# Altium schematic sheet STALO_1.SchDoc: STALO_1 (part 2 of 2)
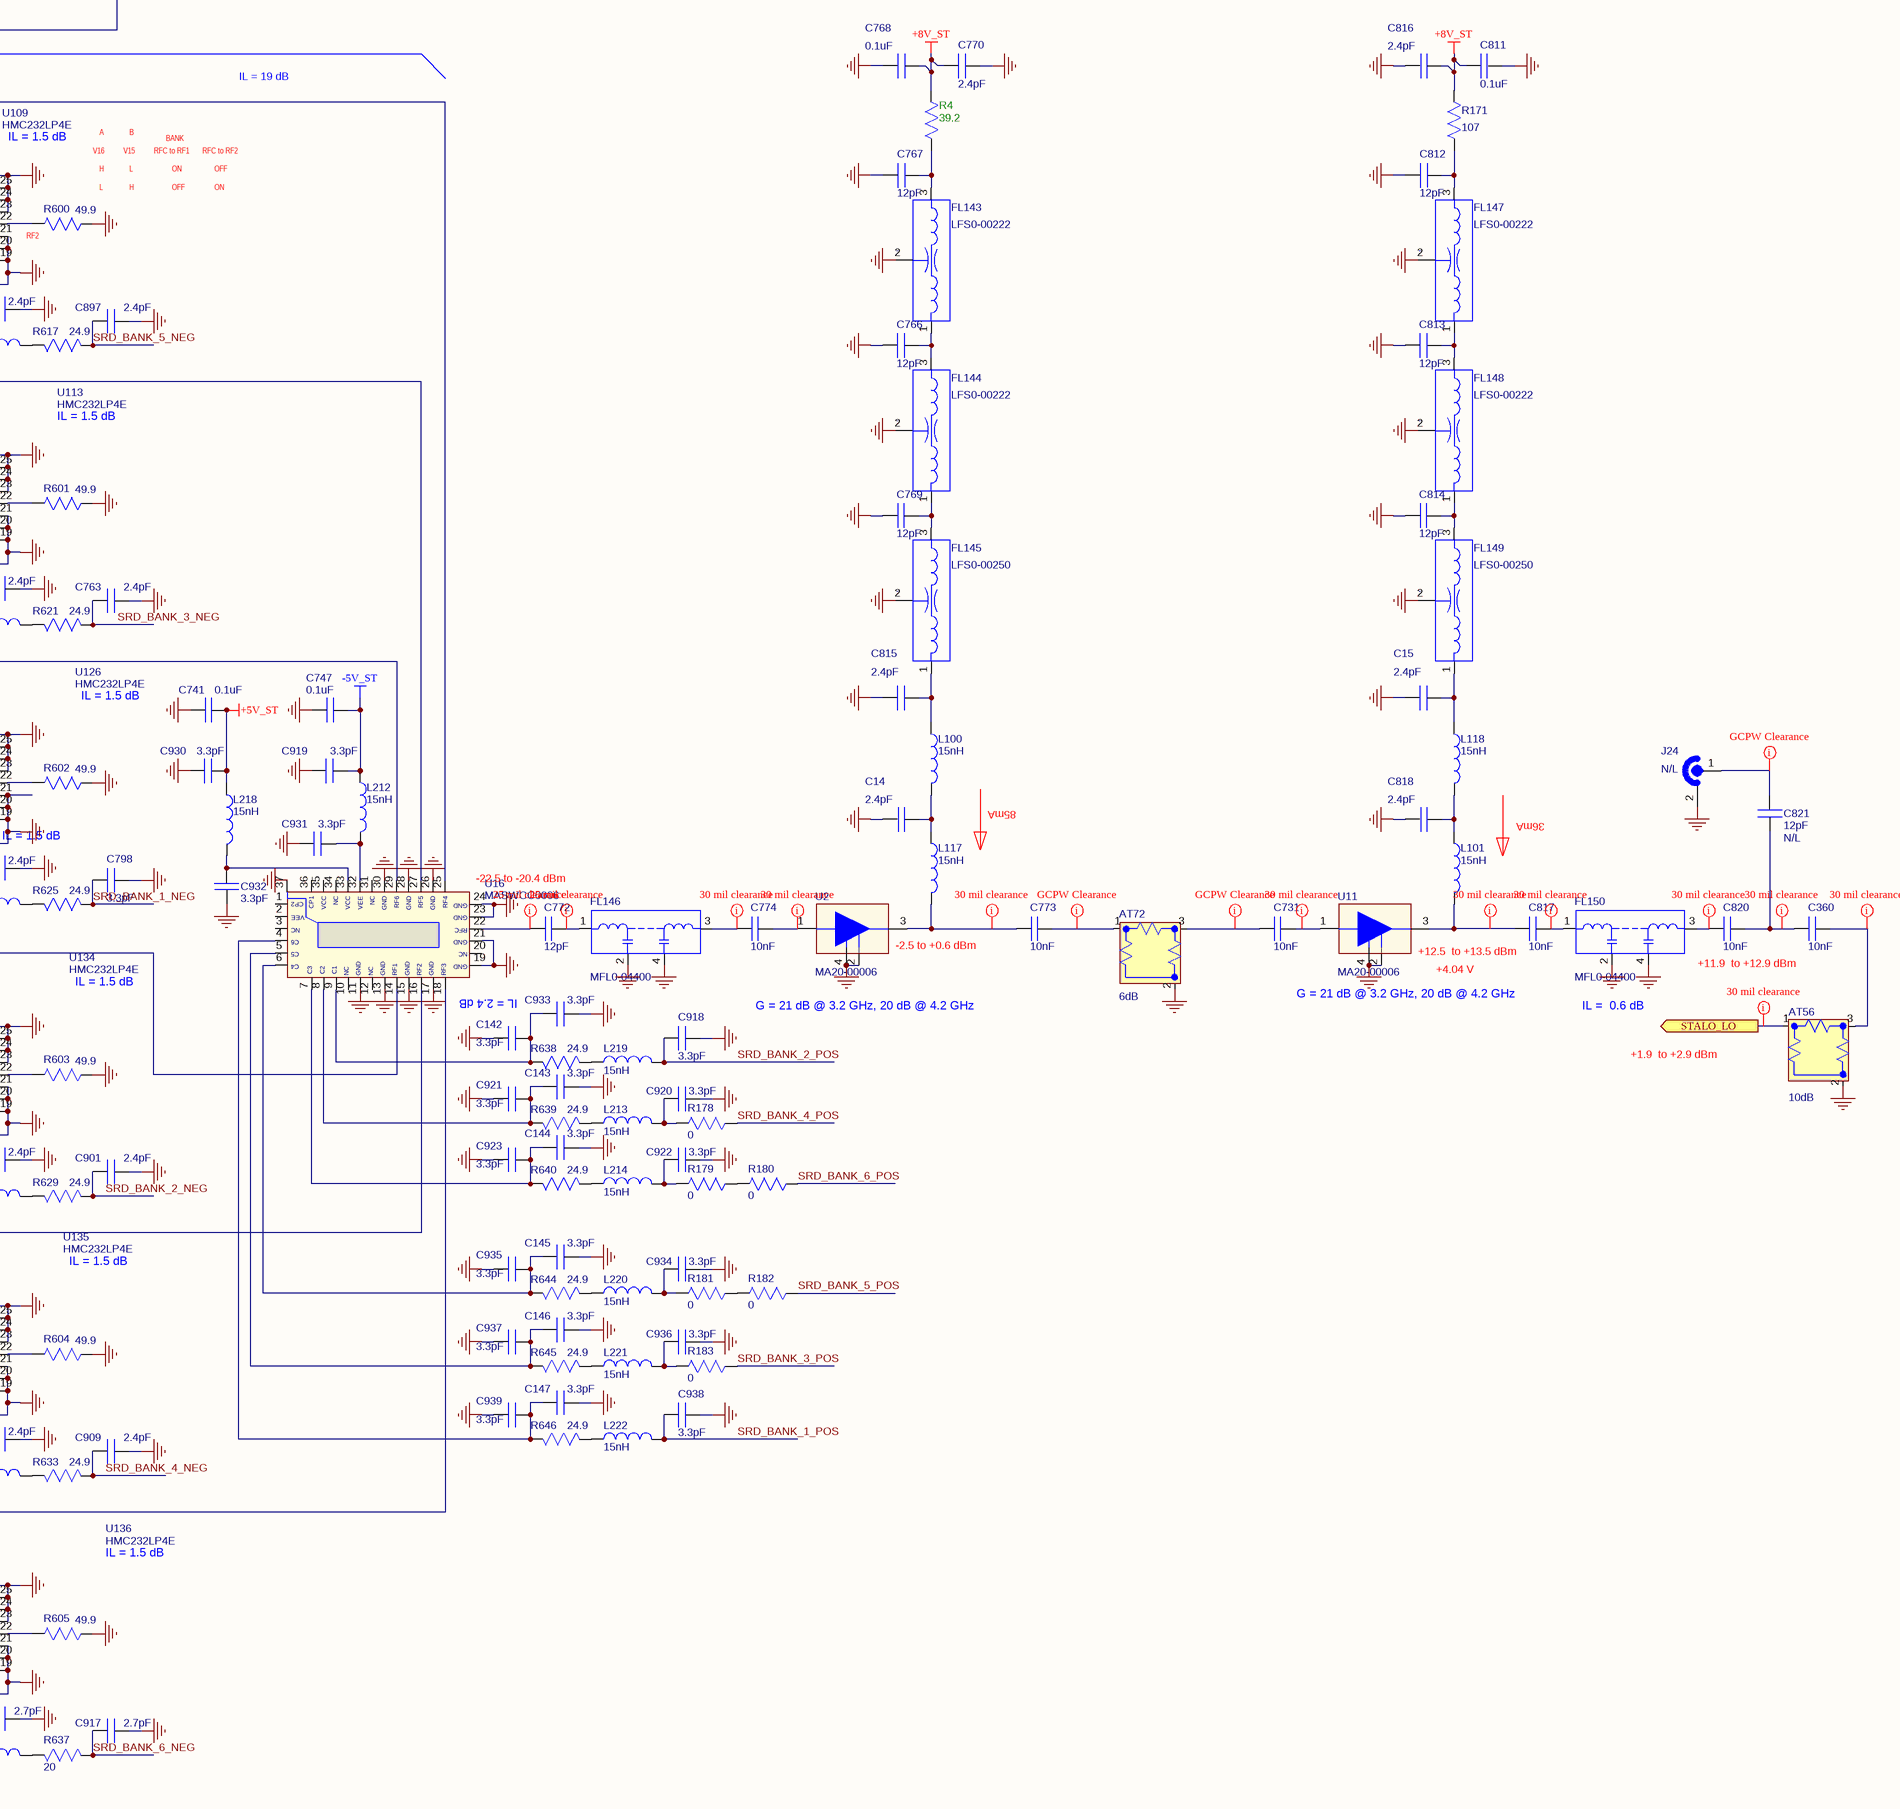
[diagram p4: STALO_1.SchDoc, bottom right]

## Notes on the sheet
- AND DESIGN RIGHTS BELONGING TO GIGA-TRONICS
- THIS DOCUMENT CONTAINS PROPRIETARY INFORMATION
- EXCEPT CALIBRATION, OPERATION, AND MAINTENANCE
- AND MAY NOT BE REPRODUCED FOR ANY REASON
- STALO PAGE 1
- WITHOUT WRITTEN AUTHORIZATION.
- IL= 6.5 - 7 dB
- 85mA
- IL = 6.5 dB
- -23 to -20 dBm
- 2.5 to 5 dBm
- (near U1) CL = 8 dB
- (near C789) G = 21 dB @ 3.2 GHz, 20 dB @ 4.2 GHz
- -3.5 to -1.4 dBm
- 14.2 dBm
- 1.2 GHz  -137dBc
- 3.6 GHz  -124dBc
- IL = 19 dB
- V16
- H
- A
- V15
- L
- B
- RFC to RF1
- BANK
- ON
- RFC to RF2
- (near C732) OFF
- (near U5) RFC
- IL = 3.5 dB
- BANK 5
- RFC
- IL = 1.5 dB
- (near R600) L
- OFF
- (near C732) ON
- RF1
- (near R1) RF2
- (near C777) RF1
- (near R600) RF2
- (near R1) IL = 1.5 dB
- BANK 3
- BANK 1
- (near U126) IL = 1.5 dB
- 36mA
- (near U14) [datasheet] <http://www.macomtech.com/DataSheets/MASWCC0006.pdf>
- (near U16) -22.5 to -20.4 dBm
- (near U2) -2.5 to +0.6 dBm
- (near U11) +12.5  to +13.5 dBm
- (near U11) +4.04 V
- (near FL150) +11.9  to +12.9 dBm
- (near U14) IL = 2.4 dB
- BANK 2
- IL = 2.4 dB
- G = 21 dB @ 3.2 GHz, 20 dB @ 4.2 GHz
- (near FL150) IL =  0.6 dB
- +1.9  to +2.9 dBm
- BANK 4
- BANK 6
- 1.     CAPACITORS VALUES ARE IN pF
- 2.     RESISTOR  VALUES ARE IN OHMS
- NOTES:
- UNLESS OTHERWISE SPECIFIED
- Title
- Sheet Title
- PRINTED DOCUMENT IS CONSIDERED UNCONTROLLED. VERIFY REVISION IN PLM SYSTEM.
- THIS DOCUMENT CONTAINS PROPRIETARY INFORMATION. DESIGN RIGHTS BELONG TO GIGA-TRONICS AND MAY NOT BE REPRODUCED WITHOUT WRITTEN AUTHORIZATION FOR ANY REASON EXCEPT CALIBRATION, OPERATION AND MAINTENANCE.
- Size
- CAGE CODE
- Filename
- D
- Document Number
- 58900
- Date
- Sheet
- Rev
- of
- (in symbol LFS0-00222) ,
- (in symbol LFS0-00250) ,
- (in symbol MRSS-12012) GND

## Library data of the parts
AT1 AT3 AT6 AT10 AT12 AT14 AT46-AT52 = MPFC-A1002: NoLoad: .; Approved: CL; M_PN: IMS1141-02DB; MFGR: IMS RESISTORS; level: 1; line_number: 10; ModifyDate: 3/8/13; G_PN: MPFC-A1002; item_number: MPFC-A1002
AT43 AT44 = MPFC-A1005: NoLoad: .; Approved: CL; M_PN: IMS1141-05DB; MFGR: IMS RESISTORS; level: 1; line_number: 45; ModifyDate: 3/8/13; G_PN: MPFC-A1005; item_number: MPFC-A1005
AT45 = MPFC-A1000: NoLoad: .; Approved: CL; M_PN: IMS1141-00DB; MFGR: IMS RESISTORS; level: 1; line_number: 50; ModifyDate: 4/16/13; G_PN: MPFC-A1000; item_number: MPFC-A1000
AT56 = MPFC-A1010: NoLoad: .; Approved: CL; M_PN: IMS1141-10DB; MFGR: IMS RESISTORS; level: 1; line_number: 55; ModifyDate: 4/23/13; G_PN: MPFC-A1010; item_number: MPFC-A1010
AT72 = MPFC-A1006: NoLoad: .; Approved: CL; M_PN: IMS1141-06DB; MFGR: IMS RESISTORS; level: 1; line_number: 35; ModifyDate: 3/8/13; G_PN: MPFC-A1006; item_number: MPFC-A1006
C1 C13-C15 C187 C754 C755 C758-C764 C770 C771 C778 C779 C786 C791 C792 C803 C804 C809 C810 C815 C816 C818 C894-C901 C904-C909 C914 C915 = CK41-00024: MFGR: ATC; M_PN: 600L2R4AT200; Approved: CL; NoLoad: .; level: 1; line_number: 60; ModifyDate: 02/09/13; G_PN: CK41-00024; item_number: CK41-00024
C2 C768 C811 = CK45-04100: Approved: CL; NoLoad: .; MFGR: ANY; level: 1; line_number: 105; ModifyDate: 02/22/12; G_PN: CK45-04100; M_PN: ANY; item_number: CK45-04100
C3 C4 C717 C766 C767 C769 C812-C814 = CK40-00120: MFGR: ANY; Approved: CL; NoLoad: .; level: 1; line_number: 165; ModifyDate: 10/06/12; M_PN: ANY; G_PN: CK40-00120; item_number: CK40-00120
C5 C10 C732 C733 C736 C738 C739 C744 C745 C748 C749 C751 C752 C772 C775 C777 C781 C783 C784 C788 C790 C794 C796 C800 C802 C806 C808 = CK40-00120: Approved: CL; NoLoad: .; MFGR: ANY; level: 1; line_number: 165; G_PN: CK40-00120; ModifyDate: 10/06/12; M_PN: ANY; item_number: CK40-00120
C6 = CK41-00016: Approved: CL; NoLoad: .; M_PN: 600L1R6AT200; MFGR: ATC; level: 1; line_number: 240; G_PN: CK41-00016; ModifyDate: 4/15/13; item_number: CK41-00016
C7 C8 = CK41-00030: Approved: CL; NoLoad: .; M_PN: 600L3R0AT200; MFGR: ATC; level: 1; line_number: 265; G_PN: CK41-00030; ModifyDate: 02/22/12; item_number: CK41-00030
C9 C11 = CK41-00027: Approved: CL; NoLoad: .; M_PN: 600L2R7AT200; MFGR: ATC; level: 1; line_number: 305; G_PN: CK41-00027; ModifyDate: 4/15/13; item_number: CK41-00027
C142-C147 C387-C392 C436-C439 C756 C757 C765 C785 C797 C798 C902 C903 C910 C911 C918-C945 = CK35-00033: MFGR: VENKEL; M_PN: C0201C0G500-3R3BNP; Approved: CL; NoLoad: .; level: 1; line_number: 155; ModifyDate: 6/24/13; G_PN: CK35-00033; item_number: CK35-00033
C360 C731 C773 C774 C817 C820 = TCC3-03100: Approved: CL; NoLoad: .; MFGR: ATC; M_PN: ATC520L103KT16T; level: 1; line_number: 90; G_PN: TCC3-03100; ModifyDate: 4/26/13; item_number: TCC3-03100
C741-C743 C747 = CK40-04100: Approved: CL; MFGR: VENKEL; M_PN: C0402X7R160-104KNP; NoLoad: .; level: 1; line_number: 95; ModifyDate: 3/29/13; G_PN: CK40-04100; item_number: CK40-04100
C789 C821 = CK40-00120: Approved: CL; MFGR: ANY; level: 1; line_number: 165; G_PN: CK40-00120; ModifyDate: 10/06/12; M_PN: ANY; item_number: CK40-00120
C912 C913 C916 C917 = CK35-00027: MFGR: VENKEL; M_PN: C0201C0G500-2R7BNP; Approved: CL; NoLoad: .; level: 1; line_number: 310; ModifyDate: 6/13/13; G_PN: CK35-00027; item_number: CK35-00027
FL1 FL2 FL143 FL144 FL147 FL148 = LFS0-00222: Approved: CL; NoLoad: .; M_PN: NFE31PT222Z1E9BL; MFGR: MURATA; level: 1; line_number: 335; G_PN: LFS0-00222; ModifyDate: 02/22/12; Value: 2200pF; item_number: LFS0-00222
FL3 FL145 FL149 = LFS0-00250: Approved: NM; NoLoad: .; M_PN: NFL18ST207X1C3; MFGR: MURATA; level: 1; line_number: 415; ModifyDate: 02/22/12; Value: 25pF; G_PN: LFS0-00250; item_number: LFS0-00250
FL4 = MFH0-03100: MFGR: MINI-CIRCUITS; Approved: CL; Value: HFCN-3100D+; NoLoad: .; level: 1; line_number: 445; G_PN: MFH0-03100; ModifyDate: 4/2/13; item_number: MFH0-03100
FL7 FL8 = MFB1-04000: Approved: CL; MFGR: LARK ENGINEERING; NoLoad: .; Value: 4SD4000-U70-6CC; level: 1; line_number: 465; G_PN: MFB1-04000; ModifyDate: 4/8/13; M_PN: 4SD4000-U70-6CC; item_number: MFB1-04000
FL16 FL17 = MFB1-03600: FILTER;CER;BANDPASS;3600MHZ;70MHZ BW;6-SEC;SMT; Approved: CL; MFGR: LARK ENGINEERING; NoLoad: .; level: 1; line_number: 350; ModifyDate: 4/8/13; Value: 4SD3600-U70-6CC; M_PN: 4SD3600-U70-6CC; G_PN: MFB1-03600; item_number: MFB1-03600
FL24 FL25 = MFB1-03200: Approved: CL; MFGR: LARK ENGINEERING; NoLoad: .; Value: 4SD3200-U70-6CC; level: 1; line_number: 375; ModifyDate: 4/8/13; M_PN: 4SD3200-U70-6CC; G_PN: MFB1-03200; item_number: MFB1-03200
FL30 FL31 = MFB1-03400: Approved: CL; MFGR: LARK ENGINEERING; NoLoad: .; Value: 4SD3400-U70-6CC; level: 1; line_number: 420; ModifyDate: 4/8/13; M_PN: 4SD3400-U70-6CC; G_PN: MFB1-03400; item_number: MFB1-03400
FL35 FL36 = MFB1-03800: Approved: CL; MFGR: LARK ENGINEERING; NoLoad: .; Value: 4SD3800-U70-6CC; level: 1; line_number: 435; ModifyDate: 4/8/13; M_PN: 4SD3800-U70-6CC; G_PN: MFB1-03800; item_number: MFB1-03800
FL40 FL41 = MFB1-04200: Approved: CL; MFGR: LARK ENGINEERING; NoLoad: .; Value: 4SD4200-U70-6CC; level: 1; line_number: 450; ModifyDate: 4/8/13; M_PN: 4SD4200-U70-6CC; G_PN: MFB1-04200; item_number: MFB1-04200
FL93 = MFL1-03900: NoLoad: .; Value: LFCN-3800D+; MFGR: MINI-CIRCUITS; Approved: CL; level: 1; line_number: 470; ModifyDate: 3/21/13; G_PN: MFL1-03900; item_number: MFL1-03900
FL146 FL150 = MFL0-04400: NoLoad: .; MFGR: Mini-Circuits; Approved: NM; level: 1; line_number: 340; Value: LFCN-4400; ModifyDate: 11/17/12; M_PN: LFCN-4400; G_PN: MFL0-04400; item_number: MFL0-04400
FT6 FT17 FT32 = FromToNode: level: 1; Approved: *; G_PN: *; MFGR: *; Value: *
J23 J24 = JRSM-40101: Value: 3287-6101; MFGR: SV MICROWAVE; Approved: CL; level: 1; M_PN: 3287-6101; ModifyDate: 4/10/13; G_PN: JRSM-40101; item_number: JRSM-40101
L2 L3 = LSA5-02430: MFGR: COILCRAFT; NoLoad: .; Approved: CL; M_PN: 0603HP-4N3XGLU; level: 1; line_number: 535; ModifyDate: 3/4/13; G_PN: LSA5-02430; item_number: LSA5-02430
L4 = LSA5-02870: MFGR: COILCRAFT; NoLoad: .; Approved: CL; M_PN: 0603HP-8N7XGLU; level: 1; line_number: 575; ModifyDate: 02/22/13; G_PN: LSA5-02870; item_number: LSA5-02870
L6 L7 L75 L80-L82 = LSA5-02390: MFGR: COILCRAFT; NoLoad: .; Approved: CL; M_PN: 0603HP-3N9XGLU; level: 1; line_number: 610; ModifyDate: 3/4/13; G_PN: LSA5-02390; item_number: LSA5-02390
L46 L52 L53 L58 L60-L63 L83 L86 L87 L92 = LSA5-02330: MFGR: COILCRAFT; NoLoad: .; Approved: CL; M_PN: 0603HP-3N3XGLU; level: 1; line_number: 590; ModifyDate: 02/22/12; G_PN: LSA5-02330; item_number: LSA5-02330
L64 L70 L72 L74 = LSA5-02470: MFGR: COILCRAFT; NoLoad: .; Approved: CL; M_PN: 0603HP-4N7XGLU; level: 1; line_number: 615; ModifyDate: 4/5/13; G_PN: LSA5-02470; item_number: LSA5-02470
L91 L96 L98-L118 L138 L167 L204 L205 L207-L225 = LSA6-03150: MFGR: COILCRAFT; NoLoad: .; Approved: CL; M_PN: 0402HP-15NXGLU; level: 1; line_number: 515; ModifyDate: 3/8/13; G_PN: LSA6-03150; item_number: LSA6-03150
L93-L95 L97 = LSA5-02180: MFGR: COILCRAFT; NoLoad: .; Approved: CL; M_PN: 0603HP-1N8XJLU; level: 1; line_number: 625; ModifyDate: 5/16/13; G_PN: LSA5-02180; item_number: LSA5-02180
R1 R3 R401 R596-R598 R600-R605 = RK35-00499: Approved: CL; NoLoad: .; MFGR: ANY; level: 1; line_number: 650; ModifyDate: 02/22/12; G_PN: RK35-00499; M_PN: ANY; item_number: RK35-00499
R4 R599 = RK65-00392: NoLoad: .; MFGR: VISHAY/DALE; Approved: CL; M_PN: CRCW201039R2FKEF; level: 1; line_number: 892; ModifyDate: 10/14/14; G_PN: RK65-00392; item_number: RK65-00392
R171 = RK65-01107: NoLoad: .; MFGR: VISHAY/DALE; Approved: CL; M_PN: CRCW2010107RFKEF; level: 1; line_number: 715; ModifyDate: 4/23/13; G_PN: RK65-01107; item_number: RK65-01107
R178-R183 = RK40-00000: NoLoad: .; MFGR: ANY; Approved: CL; level: 1; line_number: 710; ModifyDate: 3/27/13; M_PN: ANY; G_PN: RK40-00000; item_number: RK40-00000
R319 R322 R616-R635 R638-R649 = RK35-00249: NoLoad: .; Approved: CL; MFGR: ANY; level: 1; line_number: 655; G_PN: RK35-00249; ModifyDate: 02/22/12; M_PN: ANY; item_number: RK35-00249
R636 R637 = RK30-00200: NoLoad: .; Approved: CL; MFGR: Vishay-Dale; M_PN: CRCW020120R0FNED; level: 1; line_number: 782; G_PN: RK30-00200; ModifyDate: 7/24/13; item_number: RK30-00200
U1 = MMTD-00004: M_PN: ADE-42MH+; Approved: NM; MFGR: MINI-CIRCUITS; NoLoad: .; Value: ADE-42MH+; level: 1; line_number: 1095; G_PN: MMTD-00004; ModifyDate: 4/9/13; item_number: MMTD-00004
U2 U11 U133 = MA20-00006: M_PN: SKY65017-70LF; Approved: CL; MFGR: SKYWORKS; NoLoad: .; Value: SKY65017-70LF; level: 1; line_number: 1160; G_PN: MA20-00006; ModifyDate: 6/26/14; item_number: MA20-00006
U5 U6 U12 U19 U21 U24 U109 U113 U126 U134-U136 = MRSS-12012: MFGR: HITTITE; Approved: CL; Value: HMC232LP4E; NoLoad: .; level: 1; line_number: 1210; ModifyDate: 4/8/13; G_PN: MRSS-12012; item_number: MRSS-12012
U14 U16 = MRSS-16004: MFGR: HITTITE; Approved: CL; Value: MASWCC0006; NoLoad: .; level: 1; line_number: 1135; ModifyDate: 4/8/13; G_PN: MRSS-16004; item_number: MRSS-16004